# EAGLE schematic PCB_V1 (EAGLE 9.6.2)
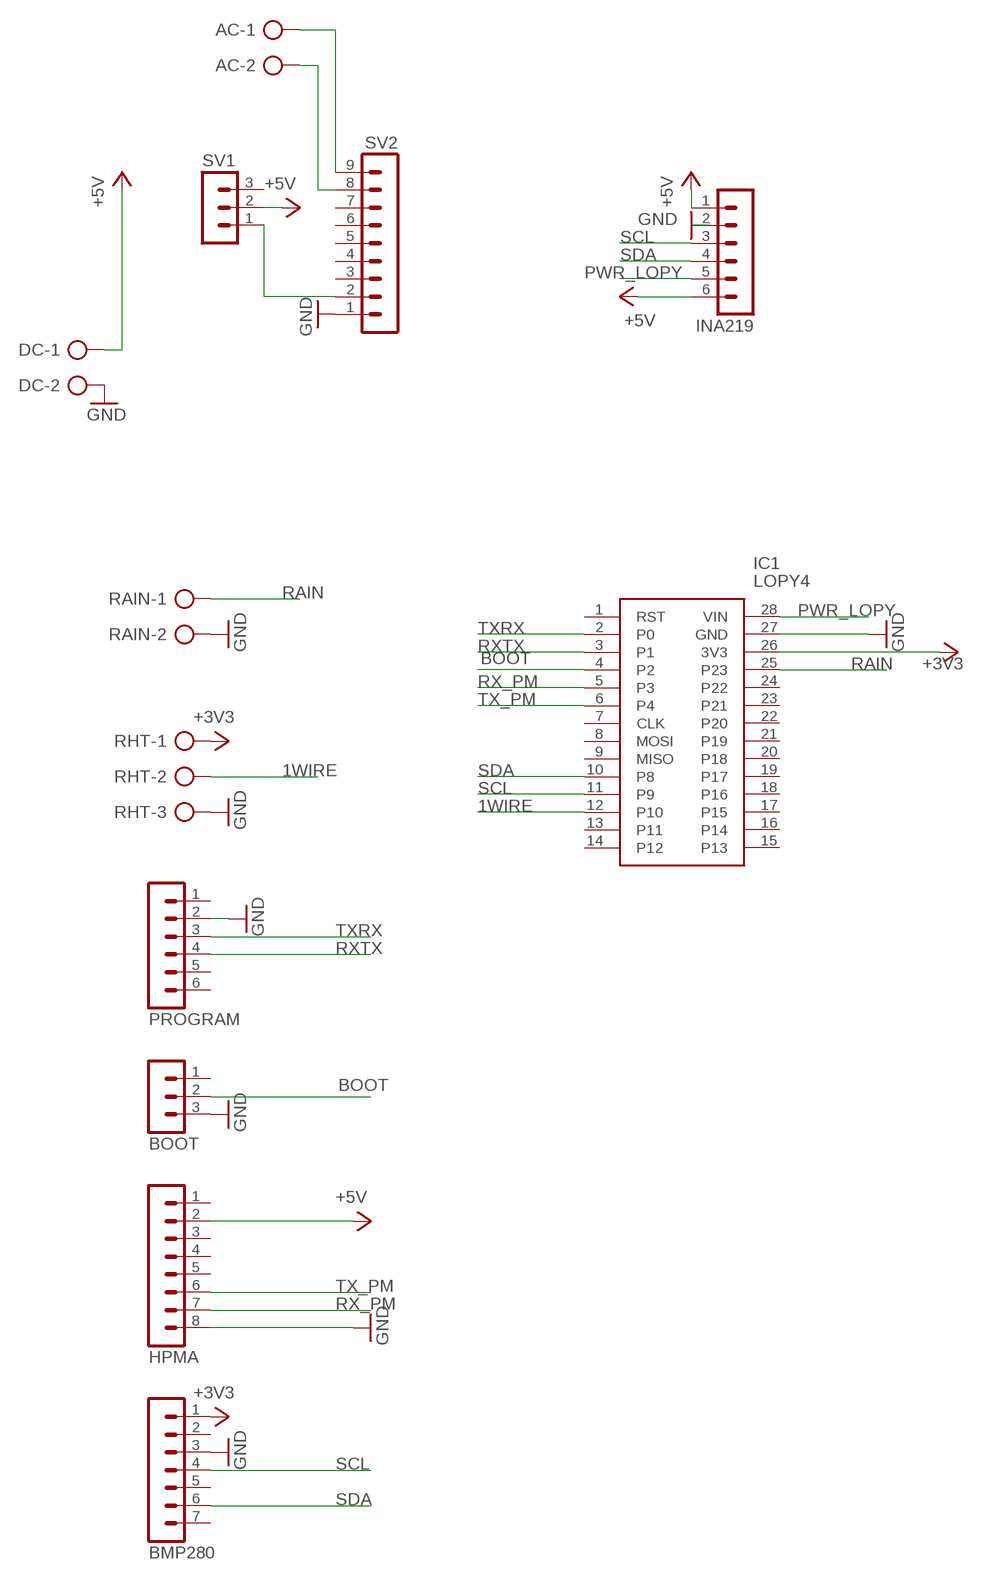
[diagram p0: schematic, sheet 1]

## Parts
AC  AK300/2  [AK300/2]
BMP280  MA07-1  [MA07-1]
BOOT  MA03-1  [MA03-1]
DC  AK300/2  [AK300/2]
HPMA  MA08-1  [MA08-1]
IC1  LOPY4  [LOPY4]
INA219  MA06-1  [MA06-1]
PROGRAM  MA06-1  [MA06-1]
RAIN  AK300/2  [AK300/2]
RHT  AK300/3  [AK300/3]
SV1  MA03-1  [MA03-1]
SV2  MA09-1  [MA09-1]

## Nets
1WIRE: IC1.12(P10) RHT.2
+3V3 [power]: BMP280.1 IC1.26(3V3) RHT.1
+5V [power]: DC.1 HPMA.2 INA219.1 INA219.6 SV1.2
BOOT: BOOT.2 IC1.4(P2)
GND [power]: BMP280.3 BOOT.3 DC.2 HPMA.8 IC1.27(GND) INA219.2 PROGRAM.2 RAIN.2 RHT.3 SV2.1
N$1: AC.1 SV2.9
N$2: AC.2 SV2.8
N$3: SV1.1 SV2.2
PWR_LOPY: IC1.28(VIN) INA219.5
RAIN: IC1.25(P23) RAIN.1
RX_PM: HPMA.7 IC1.5(P3)
RXTX: IC1.3(P1) PROGRAM.4
SCL: BMP280.4 IC1.11(P9) INA219.3
SDA: BMP280.6 IC1.10(P8) INA219.4
TX_PM: HPMA.6 IC1.6(P4)
TXRX: IC1.2(P0) PROGRAM.3
Unconnected: BMP280.2 BMP280.5 BMP280.7 BOOT.1 HPMA.1 HPMA.3 HPMA.4 HPMA.5 IC1.1(RST) IC1.7(CLK) IC1.8(MOSI) IC1.9(MISO) IC1.13(P11) IC1.14(P12) IC1.15(P13) IC1.16(P14) IC1.17(P15) IC1.18(P16) IC1.19(P17) IC1.20(P18) IC1.21(P19) IC1.22(P20) IC1.23(P21) IC1.24(P22) PROGRAM.1 PROGRAM.5 PROGRAM.6 SV1.3 SV2.3 SV2.4 SV2.5 SV2.6 SV2.7

## Library data of the parts
AC DC RAIN = con-ptr500:AK300/2: CONNECTOR; OC_FARNELL: unknown; OC_NEWARK: unknown
BMP280 = con-lstb:MA07-1: PIN HEADER; OC_FARNELL: unknown; OC_NEWARK: unknown
BOOT SV1 = con-lstb:MA03-1: PIN HEADER; OC_FARNELL: unknown; OC_NEWARK: unknown
HPMA = con-lstb:MA08-1: PIN HEADER; OC_FARNELL: unknown; OC_NEWARK: unknown
IC1 = LOPY4:LOPY4: Pycom Pycom LoPy4 Bluetooth Smart (BLE), LoRa, SigFox, WiFi Development Board Source: Datasheet <https://pycom.io/wp-content/uploads/2018/03/Pycom_Specsheet_LoPy4.pdf>; ARROW_PART_NUMBER: LOPY4; ARROW_PRICE-STOCK: https://www.arrow.com/en/products/lopy4/pycom-ltd; DESCRIPTION: Pycom Pycom LoPy4 Bluetooth Smart (BLE), LoRa, SigFox, WiFi Development Board; HEIGHT: 5mm; MANUFACTURER_NAME: Pycom; MANUFACTURER_PART_NUMBER: LOPY4; MOUSER_PART_NUMBER: 365-LOPY4; MOUSER_PRICE-STOCK: https://www.mouser.com/Search/Refine.aspx?Keyword=365-LOPY4
INA219 PROGRAM = con-lstb:MA06-1: PIN HEADER; OC_FARNELL: unknown; OC_NEWARK: unknown
RHT = con-ptr500:AK300/3: CONNECTOR; OC_FARNELL: unknown; OC_NEWARK: unknown
SV2 = con-lstb:MA09-1: PIN HEADER; OC_FARNELL: unknown; OC_NEWARK: unknown

## Net classes
1 power: width 0.508 mm